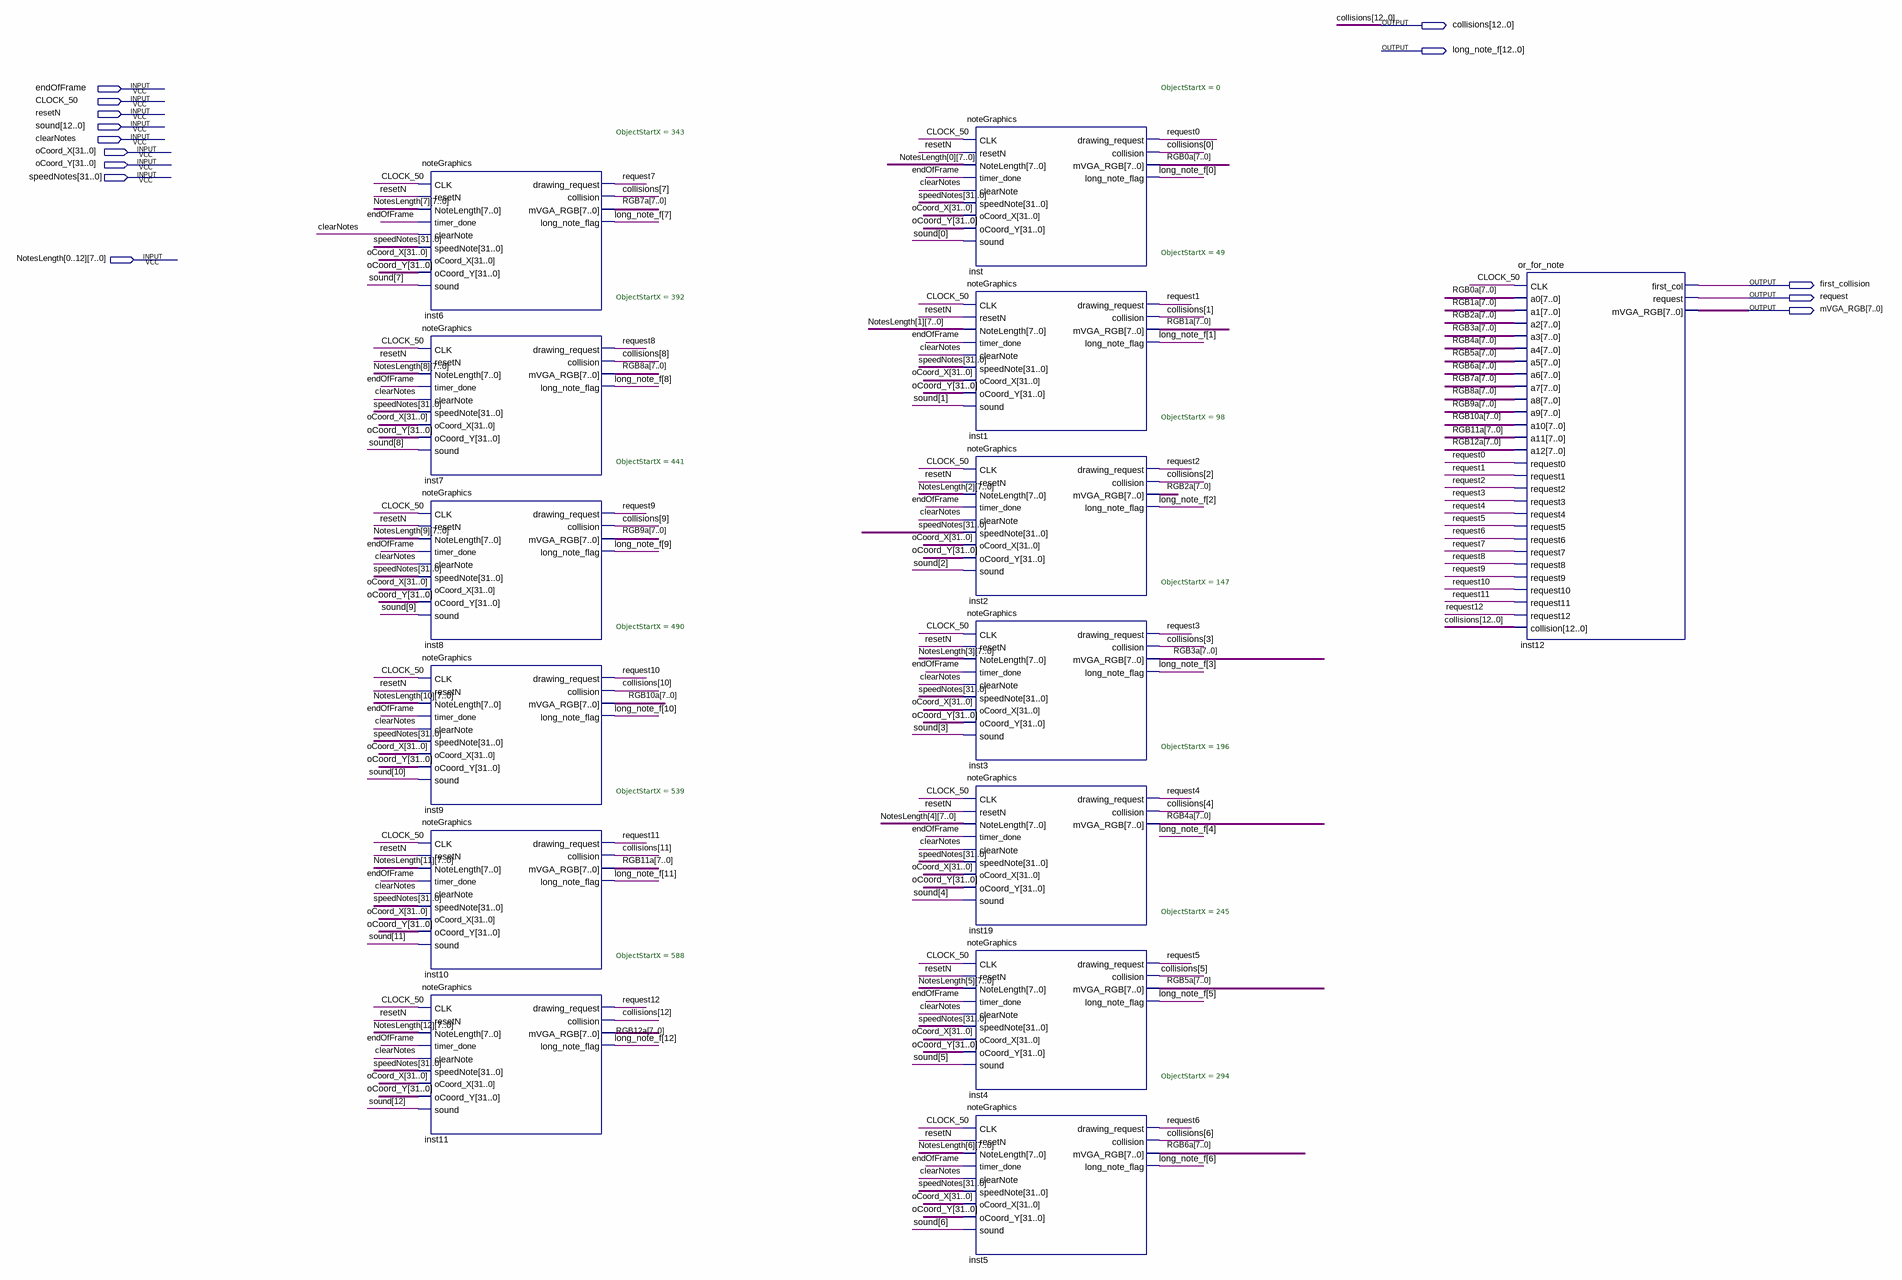
[diagram p0: schematic sheet]
// Quartus schematic top_graphics_note.bdf as structural Verilog: 14 symbols, 14 pins
module top_graphics_note (
  input  endOfFrame,
  input  CLOCK_50,
  input  resetN,
  input  [12:0] sound,
  input  clearNotes,
  input  [31:0] oCoord_X,
  input  [31:0] oCoord_Y,
  input  [31:0] speedNotes,
  input  [7:0] NotesLength_0,
  input  [7:0] NotesLength_1,
  input  [7:0] NotesLength_2,
  input  [7:0] NotesLength_3,
  input  [7:0] NotesLength_4,
  input  [7:0] NotesLength_5,
  input  [7:0] NotesLength_6,
  input  [7:0] NotesLength_7,
  input  [7:0] NotesLength_8,
  input  [7:0] NotesLength_9,
  input  [7:0] NotesLength_10,
  input  [7:0] NotesLength_11,
  input  [7:0] NotesLength_12,
  output [12:0] collisions,
  output [12:0] long_note_f,
  output first_collision,
  output request,
  output [7:0] mVGA_RGB
);

  wire request0, request1, request2, request3, request4, request5, request6, request7, request8, request9,
       request10, request11, request12;
  wire [7:0] RGB0a, RGB1a, RGB2a, RGB3a, RGB4a, RGB5a, RGB6a, RGB7a, RGB8a, RGB9a, RGB10a, RGB11a, RGB12a;

  noteGraphics #(.ObjectStartX(343)) inst6 (
    .CLK(CLOCK_50), .resetN(resetN), .NoteLength(NotesLength_7), .timer_done(endOfFrame),
    .clearNote(clearNotes), .speedNote(speedNotes), .oCoord_X(oCoord_X), .oCoord_Y(oCoord_Y),
    .sound(sound[7]), .drawing_request(request7), .collision(collisions[7]), .mVGA_RGB(RGB7a),
    .long_note_flag(long_note_f[7]));
  noteGraphics #(.ObjectStartX(392)) inst7 (
    .CLK(CLOCK_50), .resetN(resetN), .NoteLength(NotesLength_8), .timer_done(endOfFrame),
    .clearNote(clearNotes), .speedNote(speedNotes), .oCoord_X(oCoord_X), .oCoord_Y(oCoord_Y),
    .sound(sound[8]), .drawing_request(request8), .collision(collisions[8]), .mVGA_RGB(RGB8a),
    .long_note_flag(long_note_f[8]));
  noteGraphics #(.ObjectStartX(441)) inst8 (
    .CLK(CLOCK_50), .resetN(resetN), .NoteLength(NotesLength_9), .timer_done(endOfFrame),
    .clearNote(clearNotes), .speedNote(speedNotes), .oCoord_X(oCoord_X), .oCoord_Y(oCoord_Y),
    .sound(sound[9]), .drawing_request(request9), .collision(collisions[9]), .mVGA_RGB(RGB9a),
    .long_note_flag(long_note_f[9]));
  noteGraphics #(.ObjectStartX(490)) inst9 (
    .CLK(CLOCK_50), .resetN(resetN), .NoteLength(NotesLength_10), .timer_done(endOfFrame),
    .clearNote(clearNotes), .speedNote(speedNotes), .oCoord_X(oCoord_X), .oCoord_Y(oCoord_Y),
    .sound(sound[10]), .drawing_request(request10), .collision(collisions[10]), .mVGA_RGB(RGB10a),
    .long_note_flag(long_note_f[10]));
  noteGraphics #(.ObjectStartX(539)) inst10 (
    .CLK(CLOCK_50), .resetN(resetN), .NoteLength(NotesLength_11), .timer_done(endOfFrame),
    .clearNote(clearNotes), .speedNote(speedNotes), .oCoord_X(oCoord_X), .oCoord_Y(oCoord_Y),
    .sound(sound[11]), .drawing_request(request11), .collision(collisions[11]), .mVGA_RGB(RGB11a),
    .long_note_flag(long_note_f[11]));
  noteGraphics #(.ObjectStartX(588)) inst11 (
    .CLK(CLOCK_50), .resetN(resetN), .NoteLength(NotesLength_12), .timer_done(endOfFrame),
    .clearNote(clearNotes), .speedNote(speedNotes), .oCoord_X(oCoord_X), .oCoord_Y(oCoord_Y),
    .sound(sound[12]), .drawing_request(request12), .collision(collisions[12]), .mVGA_RGB(RGB12a),
    .long_note_flag(long_note_f[12]));
  noteGraphics #(.ObjectStartX(0)) inst (
    .CLK(CLOCK_50), .resetN(resetN), .NoteLength(NotesLength_0), .timer_done(endOfFrame),
    .clearNote(clearNotes), .speedNote(speedNotes), .oCoord_X(oCoord_X), .oCoord_Y(oCoord_Y),
    .sound(sound[0]), .drawing_request(request0), .collision(collisions[0]), .mVGA_RGB(RGB0a),
    .long_note_flag(long_note_f[0]));
  noteGraphics #(.ObjectStartX(49)) inst1 (
    .CLK(CLOCK_50), .resetN(resetN), .NoteLength(NotesLength_1), .timer_done(endOfFrame),
    .clearNote(clearNotes), .speedNote(speedNotes), .oCoord_X(oCoord_X), .oCoord_Y(oCoord_Y),
    .sound(sound[1]), .drawing_request(request1), .collision(collisions[1]), .mVGA_RGB(RGB1a),
    .long_note_flag(long_note_f[1]));
  noteGraphics #(.ObjectStartX(98)) inst2 (
    .CLK(CLOCK_50), .resetN(resetN), .NoteLength(NotesLength_2), .timer_done(endOfFrame),
    .clearNote(clearNotes), .speedNote(speedNotes), .oCoord_X(oCoord_X), .oCoord_Y(oCoord_Y),
    .sound(sound[2]), .drawing_request(request2), .collision(collisions[2]), .mVGA_RGB(RGB2a),
    .long_note_flag(long_note_f[2]));
  noteGraphics #(.ObjectStartX(147)) inst3 (
    .CLK(CLOCK_50), .resetN(resetN), .NoteLength(NotesLength_3), .timer_done(endOfFrame),
    .clearNote(clearNotes), .speedNote(speedNotes), .oCoord_X(oCoord_X), .oCoord_Y(oCoord_Y),
    .sound(sound[3]), .drawing_request(request3), .collision(collisions[3]), .mVGA_RGB(RGB3a),
    .long_note_flag(long_note_f[3]));
  noteGraphics #(.ObjectStartX(196)) inst19 (
    .CLK(CLOCK_50), .resetN(resetN), .NoteLength(NotesLength_4), .timer_done(endOfFrame),
    .clearNote(clearNotes), .speedNote(speedNotes), .oCoord_X(oCoord_X), .oCoord_Y(oCoord_Y),
    .sound(sound[4]), .drawing_request(request4), .collision(collisions[4]), .mVGA_RGB(RGB4a));
  noteGraphics #(.ObjectStartX(245)) inst4 (
    .CLK(CLOCK_50), .resetN(resetN), .NoteLength(NotesLength_5), .timer_done(endOfFrame),
    .clearNote(clearNotes), .speedNote(speedNotes), .oCoord_X(oCoord_X), .oCoord_Y(oCoord_Y),
    .sound(sound[5]), .drawing_request(request5), .collision(collisions[5]), .mVGA_RGB(RGB5a),
    .long_note_flag(long_note_f[5]));
  noteGraphics #(.ObjectStartX(294)) inst5 (
    .CLK(CLOCK_50), .resetN(resetN), .NoteLength(NotesLength_6), .timer_done(endOfFrame),
    .clearNote(clearNotes), .speedNote(speedNotes), .oCoord_X(oCoord_X), .oCoord_Y(oCoord_Y),
    .sound(sound[6]), .drawing_request(request6), .collision(collisions[6]), .mVGA_RGB(RGB6a),
    .long_note_flag(long_note_f[6]));
  or_for_note inst12 (
    .CLK(CLOCK_50), .a0(RGB0a), .a1(RGB1a), .a2(RGB2a), .a3(RGB3a), .a4(RGB4a), .a5(RGB5a), .a6(RGB6a),
    .a7(RGB7a), .a8(RGB8a), .a9(RGB9a), .a10(RGB10a), .a11(RGB11a), .a12(RGB12a), .request0(request0),
    .request1(request1), .request2(request2), .request3(request3), .request4(request4), .request5(request5),
    .request6(request6), .request7(request7), .request8(request8), .request9(request9),
    .request10(request10), .request11(request11), .request12(request12), .collision(collisions),
    .first_col(first_collision), .request(request), .mVGA_RGB(mVGA_RGB));
endmodule
